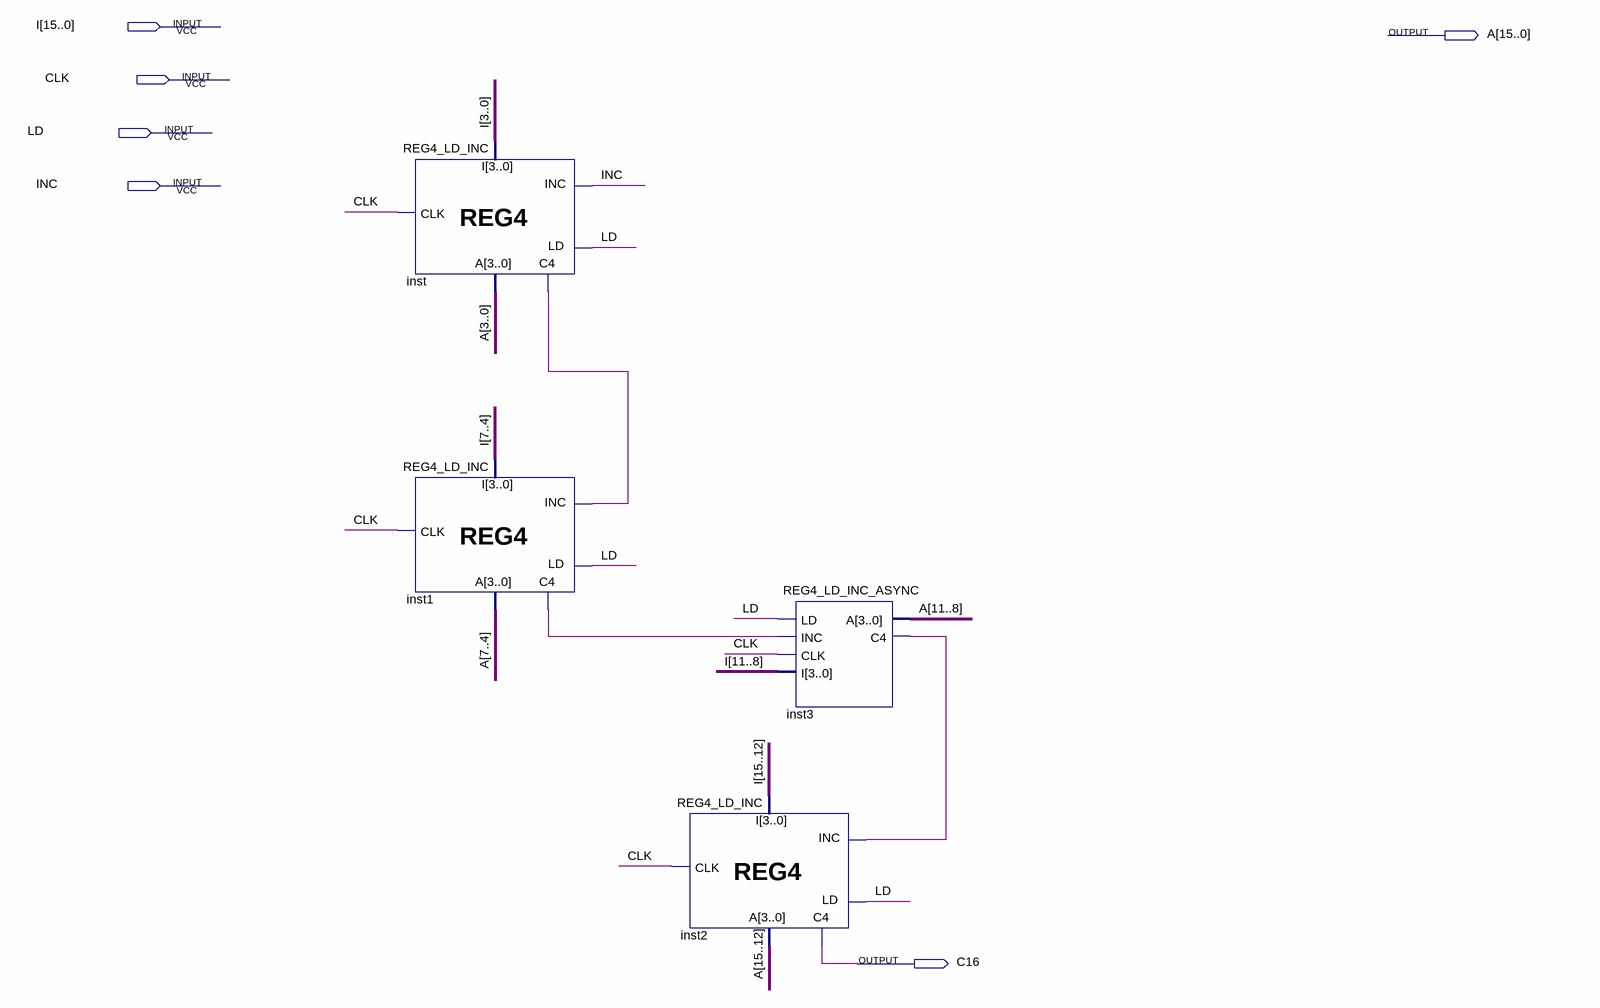
[diagram p0: schematic sheet]
// Quartus schematic PC.bdf as structural Verilog: 4 symbols, 6 pins
module PC (
  input  [15:0] I,
  input  CLK,
  input  LD,
  input  INC,
  output [15:0] A,
  output C16
);

  wire inst1_c4, inst3_c4, inst_c4;

  REG4_LD_INC inst (.LD(LD), .INC(INC), .CLK(CLK), .I(I[3:0]), .A(A[3:0]), .C4(inst_c4));
  REG4_LD_INC inst1 (.LD(LD), .INC(inst_c4), .CLK(CLK), .I(I[7:4]), .A(A[7:4]), .C4(inst1_c4));
  REG4_LD_INC inst2 (.LD(LD), .INC(inst3_c4), .CLK(CLK), .I(I[15:12]), .A(A[15:12]), .C4(C16));
  REG4_LD_INC_ASYNC inst3 (.LD(LD), .INC(inst1_c4), .CLK(CLK), .I(I[11:8]), .A(A[11:8]), .C4(inst3_c4));
endmodule
